# Altium project DSI_host_board.PrjPcb (part 2 of 2)

## Sheet adv_block.SchDoc
size A4
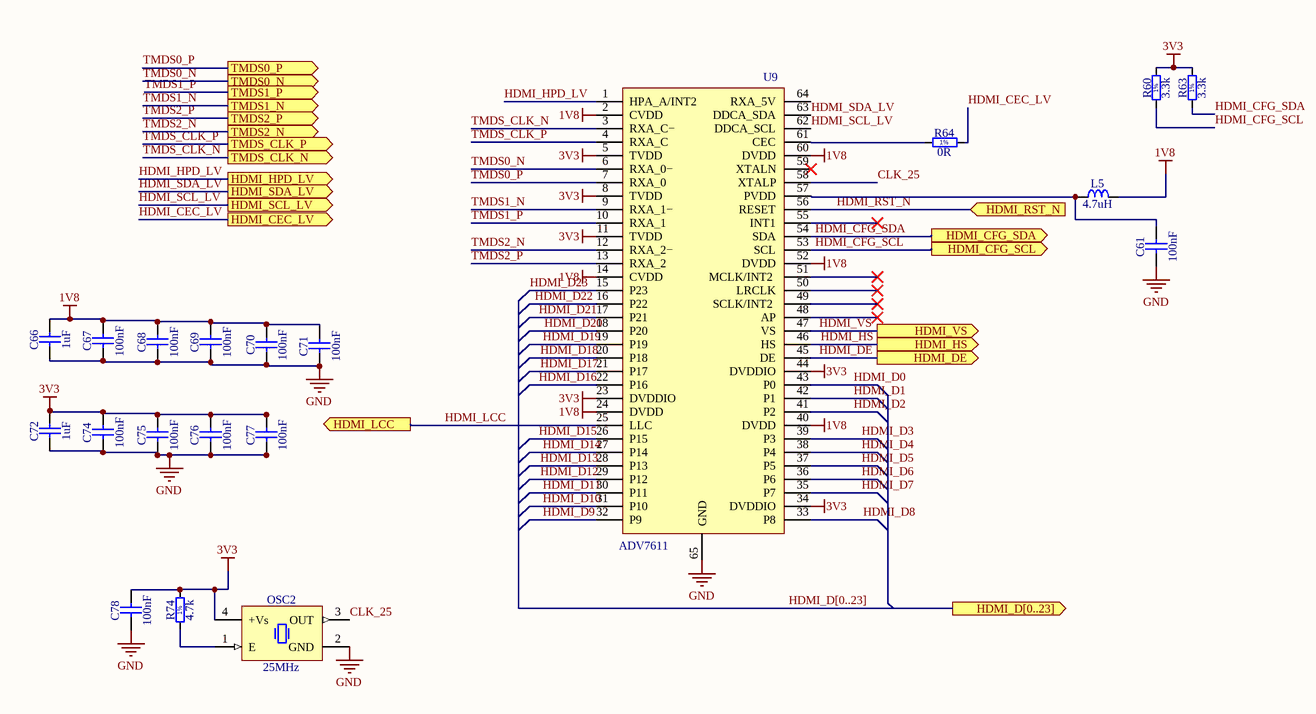
[diagram p4: adv_block.SchDoc]

### Parts
C61  100nF  [CAPC1005X55N]
C66  1uF  [CAPC1005X55N]
C67  100nF  [CAPC1005X55N]
C68  100nF  [CAPC1005X55N]
C69  100nF  [CAPC1005X55N]
C70  100nF  [CAPC1005X55N]
C71  100nF  [CAPC1005X55N]
C72  1uF  [CAPC1005X55N]
C74  100nF  [CAPC1005X55N]
C75  100nF  [CAPC1005X55N]
C76  100nF  [CAPC1005X55N]
C77  100nF  [CAPC1005X55N]
C78  100nF  [CAPC1005X55N]
L5  4.7uH  [IND_MURATA_BLM31PG]
OSC2  25MHz  [OSC_IQD_CFPS-69]
R60  3.3k  [RESC1005X40N]
R63  3.3k  [RESC1005X40N]
R64  0R  [RESC1005X40N]
R74  4.7k  [RESC1608X55N]
U9  ADV7611  [QFP50P1200X1200X120-65N-S415]

### Ports
HDMI_CEC_LV (out), HDMI_CFG_SCL (out), HDMI_CFG_SDA (out), HDMI_D[0..23] (out), HDMI_DE (out), HDMI_HPD_LV (out), HDMI_HS (out), HDMI_LCC (out), HDMI_RST_N (in), HDMI_SCL_LV (out), HDMI_SDA_LV (out), HDMI_VS (out), TMDS0_N (out), TMDS0_P (out), TMDS1_N (out), TMDS1_P (out), TMDS2_N (out), TMDS2_P (out), TMDS_CLK_N (out), TMDS_CLK_P (out)

### Nets
1V8: C66.2 C67.2 C68.2 C69.2 C70.2 C71.2 L5.2 U9.2(CVDD) U9.14(CVDD) U9.24(DVDD) U9.40(DVDD) U9.52(DVDD) U9.60(DVDD)
3V3: C72.2 C74.2 C75.2 C76.2 C77.2 C78.2 OSC2.4(+Vs) R60.2 R63.2 R74.2 U9.5(TVDD) U9.8(TVDD) U9.11(TVDD) U9.23(DVDDIO) U9.34(DVDDIO) U9.44(DVDDIO)
GND: C61.1 C66.1 C67.1 C68.1 C69.1 C70.1 C71.1 C72.1 C74.1 C75.1 C76.1 C77.1 C78.1 OSC2.2(GND) U9.65(GND)
CLK_25: OSC2.3(OUT) U9.58(XTALP)
HDMI_CEC_LV: R64.2 ; port HDMI_CEC_LV
HDMI_CFG_SCL: R60.1 U9.53(SCL) ; port HDMI_CFG_SCL
HDMI_CFG_SDA: R63.1 U9.54(SDA) ; port HDMI_CFG_SDA
HDMI_D0: U9.43(P0)
HDMI_D1: U9.42(P1)
HDMI_D2: U9.41(P2)
HDMI_D3: U9.39(P3)
HDMI_D4: U9.38(P4)
HDMI_D5: U9.37(P5)
HDMI_D6: U9.36(P6)
HDMI_D7: U9.35(P7)
HDMI_D8: U9.33(P8)
HDMI_D9: U9.32(P9)
HDMI_D10: U9.31(P10)
HDMI_D11: U9.30(P11)
HDMI_D12: U9.29(P12)
HDMI_D13: U9.28(P13)
HDMI_D14: U9.27(P14)
HDMI_D15: U9.26(P15)
HDMI_D16: U9.22(P16)
HDMI_D17: U9.21(P17)
HDMI_D18: U9.20(P18)
HDMI_D19: U9.19(P19)
HDMI_D20: U9.18(P20)
HDMI_D21: U9.17(P21)
HDMI_D22: U9.16(P22)
HDMI_D23: U9.15(P23)
HDMI_DE: U9.45(DE) ; port HDMI_DE
HDMI_HPD_LV: U9.1(HPA_A/INT2) ; port HDMI_HPD_LV
HDMI_HS: U9.46(HS) ; port HDMI_HS
HDMI_LCC: U9.25(LLC) ; port HDMI_LCC
HDMI_RST_N: U9.56(RESET) ; port HDMI_RST_N
HDMI_SCL_LV: U9.62(DDCA_SCL) ; port HDMI_SCL_LV
HDMI_SDA_LV: U9.63(DDCA_SDA) ; port HDMI_SDA_LV
HDMI_VS: U9.47(VS) ; port HDMI_VS
TMDS0_N: U9.6(RXA_0−) ; port TMDS0_N
TMDS0_P: U9.7(RXA_0) ; port TMDS0_P
TMDS1_N: U9.9(RXA_1−) ; port TMDS1_N
TMDS1_P: U9.10(RXA_1) ; port TMDS1_P
TMDS2_N: U9.12(RXA_2−) ; port TMDS2_N
TMDS2_P: U9.13(RXA_2) ; port TMDS2_P
TMDS_CLK_N: U9.3(RXA_C−) ; port TMDS_CLK_N
TMDS_CLK_P: U9.4(RXA_C) ; port TMDS_CLK_P
NetC61_2: C61.2 L5.1 U9.57(PVDD)
NetOSC2_1: OSC2.1(E) R74.1
NetR64_1: R64.1 U9.61(CEC)

Not connected (* = marked no-connect by the designer): U9 48(AP)* 49(SCLK/INT2_)* 50(LRCLK)* 51(MCLK/INT2_)* 55(INT1)* 59(XTALN)* 64(RXA_5V)

### Buses and harness runs
bus HDMI_D[0..23] = port HDMI_D[0..23]

### Notes on the sheet
- (in symbol R0402_10K_1%_0.0625W_100PPM) 1%
- (in symbol R0603_100K_1%_0.1W_100PPM) 1%

### Library data of the parts
C61 C67-C71 C74-C78 = CC0402_100NF_16V_10%_X5R: Non-polarised capacitor; Part Description: SMD Multilayer Chip Ceramic Capacitor; Manufacturer: GENERIC; Manufacturer1 Part Number: GRM155R61C104KA88D; Voltage: 16V; TC: X5R; Tolerance: ±10%; Part Number: CC0402_100NF_16V_10%_X5R; Component Kind: Standard; Component Type: Standard; Pin Count: 2; Value: 100nF; Status: None; Manufacturer Part Number: CC0402_100NF_16V_10%_X5R; Case: 0402; Mounted: Yes; Socket: No; SMD: Yes; Sense: No; Manufacturer1 Example: MURATA; Manufacturer1 ComponentHeight: 0.55mm; HelpURL: \\cern.ch\dfs\Applications\Altium\Datasheets\CC0402_X5R_MURATA_GRM.pdf; Author: CERN DEM JLC; CreateDate: 10.12.2013; LatestRevisionDate: 10.12.2013
C66 C72 = CC0402_100NF_16V_10%_X5R: Non-polarised capacitor; Part Description: SMD Multilayer Chip Ceramic Capacitor; Manufacturer: GENERIC; Manufacturer1 Part Number: GRM155R61C104KA88D; Value: 100nF; Voltage: 16V; TC: X5R; Tolerance: ±10%; Part Number: CC0402_100NF_16V_10%_X5R; Component Kind: Standard; Component Type: Standard; Pin Count: 2; Status: None; Manufacturer Part Number: CC0402_100NF_16V_10%_X5R; Case: 0402; Mounted: Yes; Socket: No; SMD: Yes; Sense: No; Manufacturer1 Example: MURATA; Manufacturer1 ComponentHeight: 0.55mm; HelpURL: \\cern.ch\dfs\Applications\Altium\Datasheets\CC0402_X5R_MURATA_GRM.pdf; Author: CERN DEM JLC; CreateDate: 10.12.2013; LatestRevisionDate: 10.12.2013
L5 = IND1206_MURATA_BLM31PG500SN1: Inductor; Part Description: SMD EMIFIL Chip Ferrite Bead; Manufacturer: MURATA; Value: 50R@100MHz; Power: 3.5A; Resistance: 0.015R; Part Number: IND1206_MURATA_BLM31PG500SN1; Component Kind: Standard; Component Type: Standard; Pin Count: 2; Status: None; Manufacturer Part Number: BLM31PG500SN1; Case: 1206; Mounted: Yes; Socket: No; SMD: Yes; Sense: No; ComponentHeight: 1.3mm; HelpURL: \\cern.ch\dfs\Applications\Altium\Datasheets\IND1206_MURATA_BLM31P.pdf; Author: CERN DEM JLC; CreateDate: 05.12.2013; LatestRevisionDate: 05.12.2013
OSC2 = OSC_50MHZ_IQD_LFSPXO009592: Oscillator 4 pins 1=E 2=GND 3=OUT 4=+Vs; Part Description: 3.3V, ±50ppm,  -40..85°C, CMOS Surface Mount Clock Oscillator, Low Current (CFPS-69 Series); Manufacturer: IQD FREQUENCY PRODUCTS; Value: 50MHz; PressFit: No; Bonding: No; Part Number: OSC_50MHZ_IQD_LFSPXO009592; Component Kind: Standard; Component Type: Standard; PackageDescription: Oscillator, Side Concave, 2.54mm Pitch, 4 Pins, 3.20mm L X 5.00mm W X 1.00mm H, CFPS-69 Series; Manufacturer Part Number: LFSPXO009592; Pin Count: 4; Mounted: Yes; Socket: No; SMD: Yes; Sense: No; ComponentHeight: 0.95mm; HelpURL: \\cern.ch\dfs\Applications\Altium\Datasheets\OSC_IQD_LFSPXO009592.pdf; Author: CERN DEM JLC; CreateDate: 16.03.2010; LatestRevisionDate: 07.11.2016
R60 R63 R64 = R0402_10K_1%_0.0625W_100PPM: Resistor - 1%; Part Description: General Purpose Thick Film Chip Resistor; Manufacturer: GENERIC; Manufacturer1 Part Number: 232270671003L; Value: 10k; TC: ±100ppm/°C; PressFit: No; Part Number: R0402_10K_1%_0.0625W_100PPM; Component Kind: Standard; Component Type: Standard; Pin Count: 2; Status: Not Recommended; Power: 0.0625W; Tolerance: ±1%; Manufacturer Part Number: R0402_10K_1%_0.0625W_100PPM; Case: 0402; Mounted: Yes; Sense: No; Socket: No; SMD: Yes; Manufacturer1 Example: YAGEO PHYCOMP; Manufacturer1 ComponentHeight: 0.4mm; HelpURL: \\cern.ch\dfs\Applications\Altium\Datasheets\R0402_Phycomp_RC0402.pdf; Author: CERN DEM JLC; CreateDate: 03.12.2007; LatestRevisionDate: 17.10.2012
R74 = R0603_100K_1%_0.1W_100PPM: as R7 on sheet sdram_block; Part Number: R0603_100K_1%_0.1W_100PPM; Component Kind: Standard; Component Type: Standard; Pin Count: 2; Status: Preferred; Tolerance: ±1%; Manufacturer Part Number: R0603_100K_1%_0.1W_100PPM; Case: 0603; Mounted: Yes; Sense: No; Socket: No; SMD: Yes; Manufacturer1 Example: NIC COMPONENT; Manufacturer1 ComponentHeight: 0.55mm; HelpURL: \\cern.ch\dfs\Applications\Altium\Datasheets\R0603_NIC_NRC.pdf; Author: CERN DEM JLC; CreateDate: 03.12.2007; LatestRevisionDate: 13.03.2008
U9 = ADV7611: Low Power 165 MHz HDMI Receiver

## Sheet power_block.SchDoc
size A4
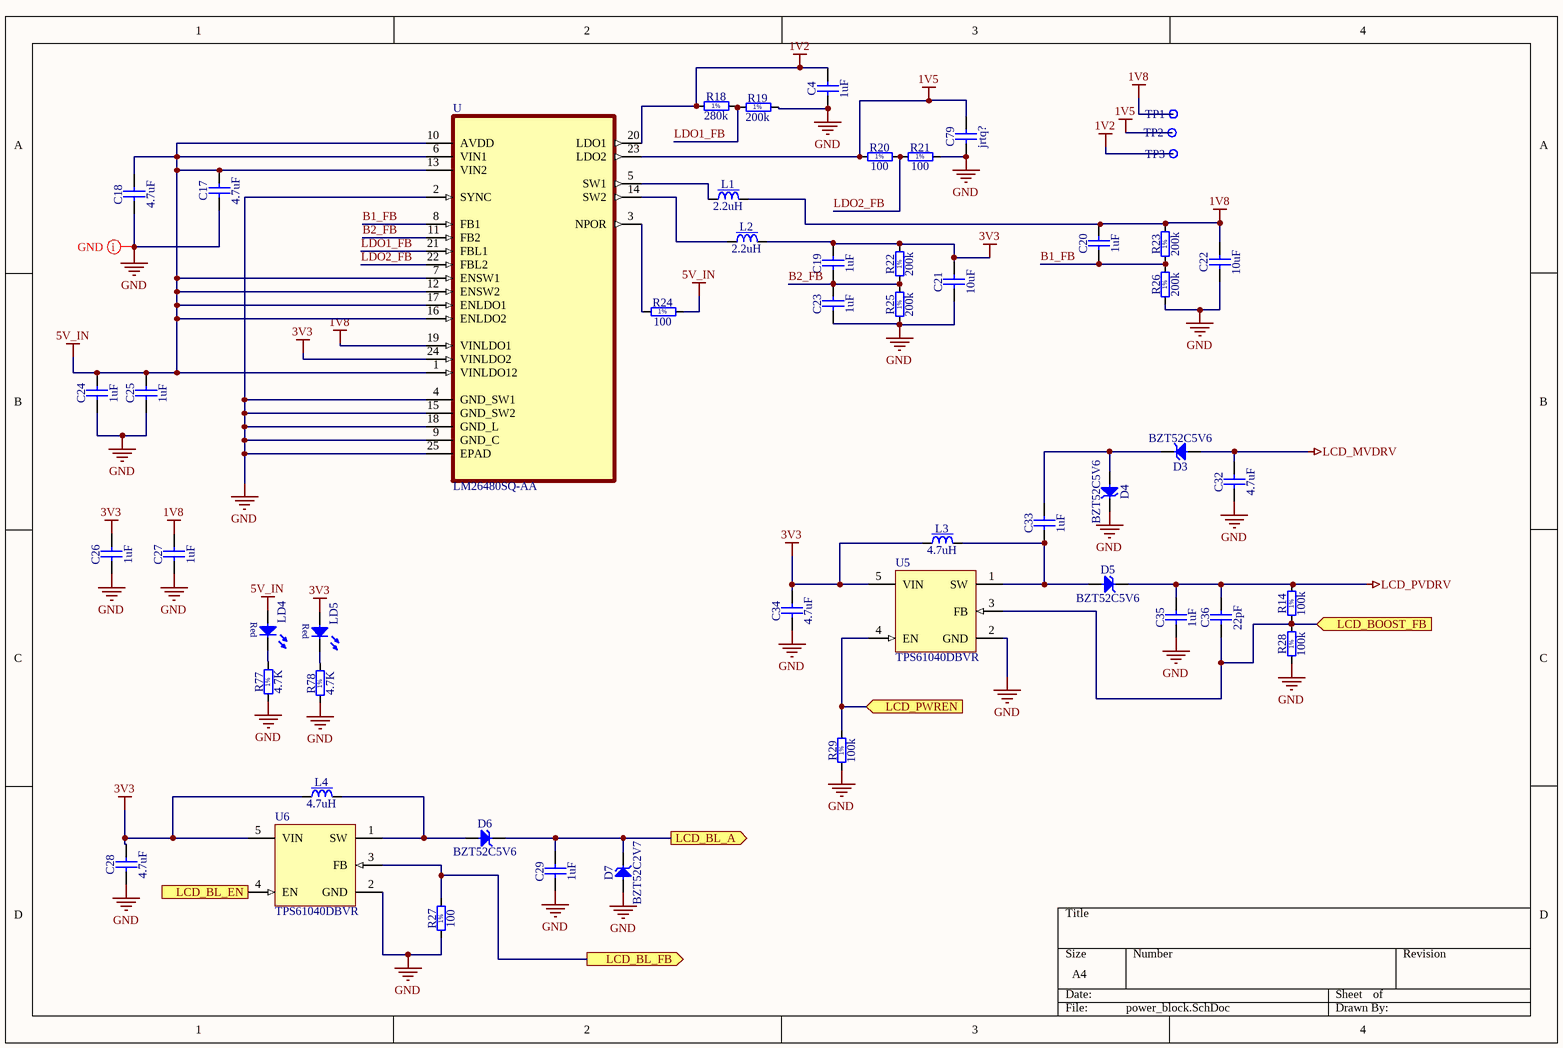
[diagram p5: power_block.SchDoc]

### Parts
C4  1uF  [CAPC2013X100N]
C17  4.7uF  [CAPC2013X100N]
C18  4.7uF  [CAPC2013X100N]
C19  1uF  [CAPC2013X100N]
C20  1uF  [CAPC2013X100N]
C21  10uF  [CAPC2013X100N]
C22  10uF  [CAPC2013X100N]
C23  1uF  [CAPC2013X100N]
C24  1uF  [CAPC2013X100N]
C25  1uF  [CAPC2013X100N]
C26  1uF  [CAPC2013X100N]
C27  1uF  [CAPC2013X100N]
C28  4.7uF  [CAPC2013X100N]
C29  1uF  [CAPC2013X100N]
C32  4.7uF  [CAPC2013X100N]
C33  1uF  [CAPC2013X100N]
C34  4.7uF  [CAPC2013X100N]
C35  1uF  [CAPC2013X100N]
C36  22pF  [CAPC2013X100N]
C79  jrtq?  [CAPC2013X100N]
D3  BZT52C5V6  [SOD3715X145N]
D4  BZT52C5V6  [SOD3715X145N]
D5  BZT52C5V6  [SOD3715X145N]
D6  BZT52C5V6  [SOD3715X145N]
D7  BZT52C2V7  [SOD3715X145N]
L1  2.2uH  [IND_MURATA-PS_8200]
L2  2.2uH  [IND_MURATA-PS_8200]
L3  4.7uH  [IND_MURATA-PS_8200]
L4  4.7uH  [IND_MURATA-PS_8200]
LD4  Super Red  [LED_OSRAM_LSR976]  (value not drawn)
LD5  Super Red  [LED_OSRAM_LSR976]  (value not drawn)
R14  100k  [RESC1608X55N]
R18  280k  [RESC1608X55N]
R19  200k  [RESC1608X55N]
R20  100  [RESC1608X55N]
R21  100  [RESC1608X55N]
R22  200k  [RESC1608X55N]
R23  200k  [RESC1608X55N]
R24  100  [RESC1608X55N]
R25  200k  [RESC1608X55N]
R26  200k  [RESC1608X55N]
R27  100  [RESC1608X55N]
R28  100k  [RESC1608X55N]
R29  100k  [RESC1608X55N]
R77  4.7K  [RESC1608X55N]
R78  4.7K  [RESC1608X55N]
TP1  Test Point  [TPS127]  (value not drawn)
TP2  Test Point  [TPS127]  (value not drawn)
TP3  Test Point  [TPS127]  (value not drawn)
U  LM26480SQ-AA  [QFN400X400X80-25N]
U5  TPS61040DBVR  [TI-DBV5_L]
U6  TPS61040DBVR  [TI-DBV5_L]

### Ports
LCD_BL_A (out), LCD_BL_EN (in), LCD_BL_FB (out), LCD_BOOST_FB (in), LCD_PWREN (in)

### Nets
1V2: C4.2 R18.1 TP3.1 U.20(LDO1)
1V5: C79.2 R20.1 TP2.1 U.23(LDO2)
1V8: C20.2 C22.2 C27.2 L1.2 R23.2 TP1.1 U.19(VINLDO1)
3V3: C19.2 C21.2 C26.2 C28.2 C34.2 L2.2 L3.1 L4.1 LD5.2(A) R22.2 U.24(VINLDO2) U5.5(VIN) U6.5(VIN)
5V_IN: C17.2 C18.2 C24.2 C25.2 LD4.2(A) R24.2 U.1(VINLDO12) U.6(VIN1) U.7(ENSW1) U.10(AVDD) U.12(ENSW2) U.13(VIN2) U.16(ENLDO2) U.17(ENLDO1)
GND: C4.1 C17.1 C18.1 C21.1 C22.1 C23.1 C24.1 C25.1 C26.1 C27.1 C28.1 C29.1 C32.1 C34.1 C35.1 C79.1 D4.1(C) D7.2(A) R19.2 R21.2 R25.1 R26.1 R27.1 R28.1 R29.1 R77.1 R78.1 U.2(SYNC) U.4(GND_SW1) U.9(GND_C) U.15(GND_SW2) U.18(GND_L) U.25(EPAD) U5.2(GND) U6.2(GND)
LCD_MVDRV: C32.2 D3.2(A)
LCD_PVDRV: C35.2 C36.2 D5.1(C) R14.2
B1_FB: C20.1 R23.1 R26.2 U.8(FB1)
B2_FB: C19.1 C23.2 R22.1 R25.2 U.11(FB2)
LCD_BL_A: C29.2 D6.1(C) D7.1(C) ; port LCD_BL_A
LCD_BL_FB: R27.2 U6.3(FB) ; port LCD_BL_FB
LCD_BOOST_FB: C36.1 R14.1 R28.2 U5.3(FB) ; port LCD_BOOST_FB
LCD_PWREN: R29.2 U5.4(EN) ; port LCD_PWREN
LDO1_FB: R18.2 R19.1 U.21(FBL1)
LDO2_FB: R20.2 R21.1 U.22(FBL2)
NetC33_1: C33.1 D5.2(A) L3.2 U5.1(SW)
NetC33_2: C33.2 D3.1(C) D4.2(A)
NetD6_2: D6.2(A) L4.2 U6.1(SW)
NetL1_1: L1.1 U.5(SW1)
NetL2_1: L2.1 U.14(SW2)
NetLD4_1: LD4.1(C) R77.2
NetLD5_1: LD5.1(C) R78.2
NetR24_1: R24.1 U.3(NPOR)
NetU6_4: U6.4(EN) ; port LCD_BL_EN

### Layout directives
rule Clearance Constraint [Clearance = 0.1mm]: GND

### Notes on the sheet
- (in symbol LED_OSRAM_LSR976) Red
- (in symbol R0603_100K_1%_0.1W_100PPM) 1%

### Library data of the parts
C4 C17-C29 C32-C36 C79 = CC0805_1.5NF_50V_5%_C0G: as C6 on sheet sdram_block; Part Number: CC0805_1.5NF_50V_5%_C0G; Component Kind: Standard; Component Type: Standard; Pin Count: 2; Status: Preferred; Manufacturer Part Number: CC0805_1.5NF_50V_5%_C0G; Case: 0805; Mounted: Yes; Socket: No; SMD: Yes; Sense: No; Manufacturer1 Example: KEMET; Manufacturer1 ComponentHeight: 1mm; HelpURL: \\cern.ch\dfs\Applications\Altium\Datasheets\CC0805_C0G_KEMET_(Commercial Grade).pdf; Author: CERN DEM BC; CreateDate: 18.11.2015; LatestRevisionDate: 18.11.2015
D3-D6 = BZT52C5V6: Zener Diode; Part Description: Surface Mount Zener Diode; Manufacturer: DIODES INCORPORATED; Voltage: 5V6; Power: 0.5W; PressFit: No; Bonding: No; Part Number: BZT52C5V6; Component Kind: Standard; Component Type: Standard; Device: BZT52C5V6; PackageDescription: SOD Diode (SOD123); 2.70mm W X 1.55mm L X 1.45mm H body, IPC Medium Density; Manufacturer Part Number: BZT52C5V6; Pin Count: 2; Case: SOD123; Mounted: Yes; Socket: No; SMD: Yes; Sense: No; ComponentHeight: 1.45mm; HelpURL: \\cern.ch\dfs\Applications\Altium\Datasheets\BZT52C5V6.pdf; Author: CERN DEM JLC; CreateDate: 02.03.2015; LatestRevisionDate: 02.03.2015
D7 = BZT52C2V7: Zener Diode; Part Description: Surface Mount Zener Diode; Manufacturer: DIODES INCORPORATED; Voltage: 2V7; Power: 500mW; PressFit: No; Bonding: No; Part Number: BZT52C2V7; Component Kind: Standard; Component Type: Standard; Device: BZT52C2V7; PackageDescription: SOD Diode (SOD123); 2.70mm W X 1.55mm L X 1.45mm H body, IPC Medium Density; Manufacturer Part Number: BZT52C2V7; Pin Count: 2; Case: SOD123; Mounted: Yes; Socket: No; SMD: Yes; Sense: No; ComponentHeight: 1.45mm; HelpURL: \\cern.ch\dfs\Applications\Altium\Datasheets\BZT52C2V7.pdf; Author: CERN DEM JLC; CreateDate: 02.03.2015; LatestRevisionDate: 02.03.2015
L1-L4 = IND_22UH_10%_MURATA-PS_8200: Inductor With Core; Part Description: Miniature Surface Mount Power Inductor (8200 Series); Manufacturer: MURATA POWER SOLUTIONS; Manufacturer Part Number: 82223C; Value: 22uH; Power: 320mA; Resistance: 0.92R; Tolerance: ±10%; Part Number: IND_22UH_10%_MURATA-PS_8200; Component Kind: Standard; Component Type: Standard; Pin Count: 2; Status: None; Mounted: Yes; Socket: No; SMD: Yes; Sense: No; ComponentHeight: 2.3mm; HelpURL: \\cern.ch\dfs\Applications\Altium\Datasheets\IND_MURATA-PS_8200.pdf; Author: CERN DEM JMW; CreateDate: 07.10.2015; LatestRevisionDate: 07.10.2015
LD4 LD5 = LED_OSRAM_LSR976: LED Red 1C 2A; Part Description: Surface Mount Super Red LED (0805 Case); Manufacturer: OSRAM; Manufacturer Part Number: LSR976; PressFit: No; Bonding: No; Part Number: LED_OSRAM_LSR976; Component Kind: Standard; Component Type: Standard; Color: Super Red; PackageDescription: Super Red Chip LED, 2-Leads, Body 2 x1.25mm, IPC Medium Density; Pin Count: 2; Case: 0805; Mounted: Yes; Socket: No; SMD: Yes; Sense: No; ComponentHeight: 0.9mm; HelpURL: \\cern.ch\dfs\Applications\Altium\Datasheets\LED_OSRAM_LSR976.pdf; Author: CERN DEM JLC; CreateDate: 18.05.2010; LatestRevisionDate: 18.05.2010
R14 R28 R29 = R0603_100K_1%_0.1W_100PPM: Resistor - 1%; Part Description: General Purpose Thick Film Chip Resistor; Manufacturer: GENERIC; Manufacturer1 Part Number: NRC06F1003TRF; Power: 0.1W; TC: ±100ppm/°C; PressFit: No; Part Number: R0603_100K_1%_0.1W_100PPM; Component Kind: Standard; Component Type: Standard; Pin Count: 2; Value: 100k; Status: Preferred; Tolerance: ±1%; Manufacturer Part Number: R0603_100K_1%_0.1W_100PPM; Case: 0603; Mounted: Yes; Sense: No; Socket: No; SMD: Yes; Manufacturer1 Example: NIC COMPONENT; Manufacturer1 ComponentHeight: 0.55mm; HelpURL: \\cern.ch\dfs\Applications\Altium\Datasheets\R0603_NIC_NRC.pdf; Author: CERN DEM JLC; CreateDate: 03.12.2007; LatestRevisionDate: 13.03.2008
R18-R27 R77 R78 = R0603_100K_1%_0.1W_100PPM: as R7 on sheet sdram_block; Part Number: R0603_100K_1%_0.1W_100PPM; Component Kind: Standard; Component Type: Standard; Pin Count: 2; Status: Preferred; Tolerance: ±1%; Manufacturer Part Number: R0603_100K_1%_0.1W_100PPM; Case: 0603; Mounted: Yes; Sense: No; Socket: No; SMD: Yes; Manufacturer1 Example: NIC COMPONENT; Manufacturer1 ComponentHeight: 0.55mm; HelpURL: \\cern.ch\dfs\Applications\Altium\Datasheets\R0603_NIC_NRC.pdf; Author: CERN DEM JLC; CreateDate: 03.12.2007; LatestRevisionDate: 13.03.2008
TP1-TP3 = SMD_PAD_1.27X1.27MM: Part Description: 1.27mm x 1.27mm PCB Copper Area (SMD Test Point); Mounted: No; Part Number: SMD_PAD_1.27X1.27MM; Component Kind: Standard (No BOM); Component Type: Standard (No BOM); Pin Count: 1; Family: Test Point; Socket: No; SMD: Yes; Sense: No; Status: None; ComponentHeight: 0mm; HelpURL: Undefined; Author: CERN DEM JLC; CreateDate: 12.01.2008; LatestRevisionDate: 12.01.2008; PackageDescription: 1.27mm x 1.27mm PCB Copper Area (SMD Test Point)
U = LM26480SQ-AA: PMIC - Voltage Regulators - Linear + Switching 4 Output Step-Down _Buck_ Synchronous _2_, Linear _LDO_ _2_ 2MHz 24-WQFN _4x4_; MF: Texas Instruments; Package: WQFN-24 Texas Instruments; MP: LM26480SQ-AA; Value: *; Availability: Unavailable; Price: None; SnapEDA_Link: https://www.snapeda.com/parts/LM26480SQ-AA/Texas%20Instruments/view-part/28484/?ref=snap
U5 U6 = TPS61040DBVR: 28 V, 400 mA Switch Boost Converter for White LED Applications, 1.8 to 6 V, -40 to 85 degC, 5-pin SOT23 (DBV5), Green (RoHS & no Sb/Br); Manufacturer: Texas Instruments; Dimming: TRUE; Iout(Max)(A): 0.09; Iq(Typ)(mA): 0.028; Rating: Catalog; SubFamily: White LED Driver; Switching Frequency(Max)(kHz): 1000; Vin(Max)(V): 6; Vin(Min)(V): 1.8; DatasheetVersion: SLVS413F; PackageVersion: 4073253-4/K; PackageReference: DBV5; PackageDescription: 5-Pin Plastic Small Outline, Body 1.60 Г— 2.90 mm, Pitch 0.95 mm; Supplier 1: Digi-Key; Supplier Part Number 1: 296-12685-2-ND; Supplier 2: Digi-Key; Supplier Part Number 2: 296-12685-1-ND; Supplier 3: Digi-Key; Supplier Part Number 3: 296-12685-6-ND; Supplier 4: Farnell; Supplier Part Number 4: 1461061; Supplier 5: Farnell; Supplier Part Number 5: 1461061RL; Supplier 6: Newark; Supplier Part Number 6: 35K1326; Supplier 7: Mouser; Supplier Part Number 7: 595-TPS61040DBVR; Eco-Plan: Green (RoHS & no Sb/Br); Topology: Boost; Mounting Technology: Surface Mount; Code_JEDEC: MO-178; PartNumber: TPS61040DBVR; ComponentLink1Description: Manufacturer URL; ComponentLink1URL: http://www.ti.com/; ComponentLink2Description: Datasheet; ComponentLink2URL: http://www.ti.com/general/docs/lit/getliterature.tsp?genericPartNumber=TPS61040&fileType=pdf; ComponentLink3Description: Package Specification; ComponentLink3URL: http://www.ti.com/litv/pdf/mpds018i

## Sheet uartjtag_block.SchDoc
size A4
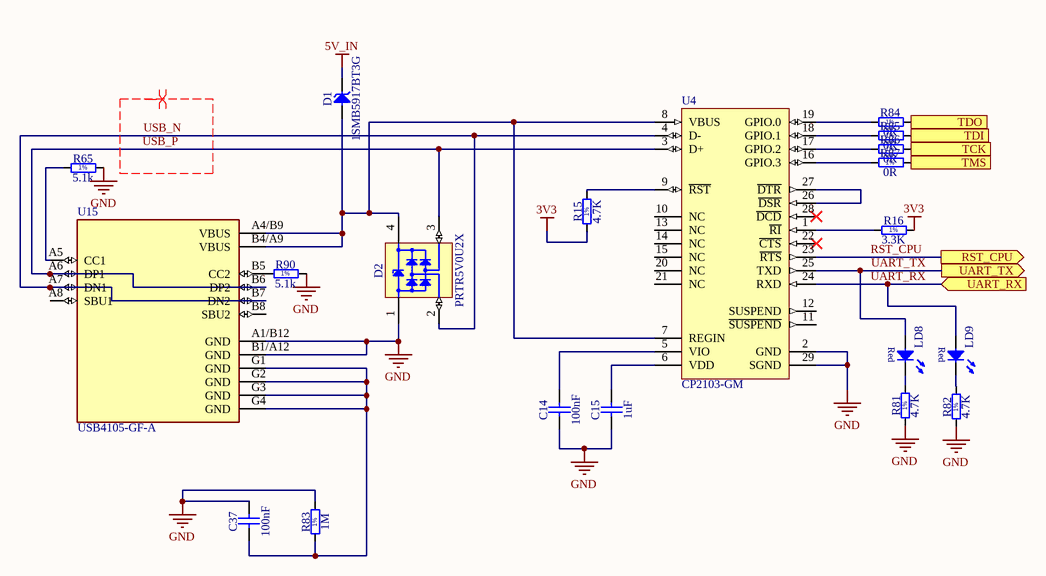
[diagram p6: uartjtag_block.SchDoc]

### Parts
C14  100nF  [CAPC2013X100N]
C15  1uF  [CAPC2013X100N]
C37  100nF  [CAPC2013X100N]
D1  1SMB5917BT3G  [DIOM5436X244N]
D2  PRTR5V0U2X  [SOT190P230X110-4N]
LD8  Super Red  [LED_OSRAM_LSR976]  (value not drawn)
LD9  Super Red  [LED_OSRAM_LSR976]  (value not drawn)
R15  4.7K  [RESC1608X55N]
R16  3.3K  [RESC1608X55N]
R65  5.1k  [RESC1608X55N]
R81  4.7K  [RESC1608X55N]
R82  4.7K  [RESC1608X55N]
R83  1M  [RESC1608X55N]
R84  0R  [RESC1608X55N]
R85  0R  [RESC1608X55N]
R86  0R  [RESC1608X55N]
R87  0R  [RESC1608X55N]
R90  5.1k  [RESC1608X55N]
U4  CP2103-GM  [SLAB-QFN-28-3125x3125TP_A_L]
U15  USB4105-GF-A  [GCT_USB4105-GF-A]

### Ports
RST_CPU (out), TCK (out), TDI (out), TDO (in), TMS (out), UART_RX (in), UART_TX (out)

### Nets
3V3: R15.1 R16.2
5V_IN: D1.1(C)
GND: C14.1 C15.1 C37.2 D2.1(GND) R65.2 R81.1 R82.1 R83.2 R90.2 U4.2(GND) U4.29(SGND) U15.A1/B12(GND) U15.B1/A12(GND)
RST_CPU: U4.23(~{RTS}) ; port RST_CPU
TCK: R86.2 ; port TCK
TDI: R85.2 ; port TDI
TDO: R84.2 ; port TDO
TMS: R87.2 ; port TMS
UART_RX: LD9.2(A) U4.24(RXD) ; port UART_RX
UART_TX: LD8.2(A) U4.25(TXD) ; port UART_TX
USB_N: D2.2(I/O1) U4.4(D-) U15.A7(DN1) U15.B7(DN2)
USB_P: D2.3(I/O2) U4.3(D+) U15.A6(DP1) U15.B6(DP2)
NetC14_2: C14.2 U4.5(VIO)
NetC15_2: C15.2 U4.6(VDD)
NetC37_1: C37.1 R83.1 U15.G1(GND) U15.G2(GND) U15.G3(GND) U15.G4(GND)
NetD1_2: D1.2(A) D2.4(VCC) U4.7(REGIN) U4.8(VBUS) U15.A4/B9(VBUS) U15.B4/A9(VBUS)
NetLD8_1: LD8.1(C) R81.2
NetLD9_1: LD9.1(C) R82.2
NetR15_2: R15.2 U4.9(~{RST})
NetR16_1: R16.1 U4.1(~{RI})
NetR65_1: R65.1 U15.A5(CC1)
NetR84_1: R84.1 U4.19(GPIO.0)
NetR85_1: R85.1 U4.18(GPIO.1)
NetR86_1: R86.1 U4.17(GPIO.2)
NetR87_1: R87.1 U4.16(GPIO.3)
NetR90_1: R90.1 U15.B5(CC2)
NetU4_26: U4.26(~{DSR}) U4.27(~{DTR})

Not connected (* = marked no-connect by the designer): U4 10(NC) 11(~{SUSPEND}) 12(SUSPEND) 13(NC) 14(NC) 15(NC) 20(NC) 21(NC) 22(~{CTS})* 28(~{DCD})*; U15 A8(SBU1) B8(SBU2)

### Layout directives
differential pair; net class USB_LINES; rule Differential Pairs Routing [Pref Gap = 0.2mm    Min Gap  = 0.2mm    Max Gap  = 0.3mmPref Width = 0.2mm    Min Width  = 0.2mm    Max Width  = 0.3mm]: USB_N, USB_P

### Notes on the sheet
- (in symbol LED_OSRAM_LSR976) Red
- (in symbol R0603_100K_1%_0.1W_100PPM) 1%

### Library data of the parts
C14 C15 C37 = CC0805_1.5NF_50V_5%_C0G: as C6 on sheet sdram_block; Part Number: CC0805_1.5NF_50V_5%_C0G; Component Kind: Standard; Component Type: Standard; Pin Count: 2; Status: Preferred; Manufacturer Part Number: CC0805_1.5NF_50V_5%_C0G; Case: 0805; Mounted: Yes; Socket: No; SMD: Yes; Sense: No; Manufacturer1 Example: KEMET; Manufacturer1 ComponentHeight: 1mm; HelpURL: \\cern.ch\dfs\Applications\Altium\Datasheets\CC0805_C0G_KEMET_(Commercial Grade).pdf; Author: CERN DEM BC; CreateDate: 18.11.2015; LatestRevisionDate: 18.11.2015
D1 = 1SMB5917BT3G: Zener Diode; Part Description: Plastic Surface Mount Zener Voltage Regulator Diode; Manufacturer: ON SEMICONDUCTOR; Voltage: 4.7V; Power: 3W; PressFit: No; Bonding: No; Part Number: 1SMB5917BT3G; Component Kind: Standard; Component Type: Standard; Device: 1SMB5917BT3G; PackageDescription: DO-214-AA/SMB Diode, Molded Body; 5.40mm L X 3.62mm W X 2.44mm H, IPC Medium Density; Manufacturer Part Number: 1SMB5917BT3G; Pin Count: 2; Case: SMB; Mounted: Yes; Socket: No; SMD: Yes; Sense: No; ComponentHeight: 2.44mm; HelpURL: \\cern.ch\dfs\Applications\Altium\Datasheets\1SMB5917BT3G.pdf; Author: CERN DEM MR; CreateDate: 05.09.2016; LatestRevisionDate: 05.09.2016
D2 = PRTR5V0U2X: Ultra Low Capacitance Double Rail-to-Rail ESD Protection Diode; Part Description: Ultra Low Capacitance (1pF) Double Rail-to-Rail ESD Protection Diode (8kV); Manufacturer: NXP SEMICONDUCTORS; Voltage: 5.5V; PressFit: No; Bonding: No; Part Number: PRTR5V0U2X; Component Kind: Standard; Component Type: Standard; Device: PRTR5V0U2X; PackageDescription: SOT143B, SOT, 1.90mm Pitch; 4 Pin, 1.30mm W X 2.90mm L X 1.10mm H body, IPC Medium Density; Manufacturer Part Number: PRTR5V0U2X; Pin Count: 4; Case: SOT143B; Mounted: Yes; Socket: No; SMD: Yes; Sense: No; ComponentHeight: 1.1mm; HelpURL: \\cern.ch\dfs\Applications\Altium\Datasheets\PRTR5V0U2X.pdf; Author: CERN DEM JLC; CreateDate: 22.03.2011; LatestRevisionDate: 22.03.2011
LD8 LD9 = LED_OSRAM_LSR976: as LD4 on sheet power_block; Part Number: LED_OSRAM_LSR976; Component Kind: Standard; Component Type: Standard; Color: Super Red; PackageDescription: Super Red Chip LED, 2-Leads, Body 2 x1.25mm, IPC Medium Density; Pin Count: 2; Case: 0805; Mounted: Yes; Socket: No; SMD: Yes; Sense: No; ComponentHeight: 0.9mm; HelpURL: \\cern.ch\dfs\Applications\Altium\Datasheets\LED_OSRAM_LSR976.pdf; Author: CERN DEM JLC; CreateDate: 18.05.2010; LatestRevisionDate: 18.05.2010
R15 R16 R65 R81-R87 R90 = R0603_100K_1%_0.1W_100PPM: as R7 on sheet sdram_block; Part Number: R0603_100K_1%_0.1W_100PPM; Component Kind: Standard; Component Type: Standard; Pin Count: 2; Status: Preferred; Tolerance: ±1%; Manufacturer Part Number: R0603_100K_1%_0.1W_100PPM; Case: 0603; Mounted: Yes; Sense: No; Socket: No; SMD: Yes; Manufacturer1 Example: NIC COMPONENT; Manufacturer1 ComponentHeight: 0.55mm; HelpURL: \\cern.ch\dfs\Applications\Altium\Datasheets\R0603_NIC_NRC.pdf; Author: CERN DEM JLC; CreateDate: 03.12.2007; LatestRevisionDate: 13.03.2008
U4 = CP2103-GM: Single-Chip USB to UART Bridge, 1024 Bytes EEPROM, -40 to 85 degC, 28-pin QFN, Tube; Manufacturer: Silicon Labs; Internal Oscillator: TRUE; Sub-Family: USB Bridges; DatasheetVersion: Rev. 1.0; PackageReference: QFN-28; PackageDescription: 28-Pin Quad-Flat No-Leads Package, Body 5 x 5 mm, Pitch 0.5 mm; Supplier 1: Digi-Key; Supplier Part Number 1: 336-1164-ND; Supplier 2: Farnell; Supplier Part Number 2: 1291538; Supplier 3: Newark; Supplier Part Number 3: 24M1109; Supplier 4: Mouser; Supplier Part Number 4: 634-CP2103-GM; EEPROM: 1024 Bytes; Mounting Technology: Surface Mount; PartNumber: CP2103-GM; ComponentLink1Description: Manufacturer URL; ComponentLink1URL: http://www.silabs.com/; ComponentLink2Description: Datasheet; ComponentLink2URL: http://www.silabs.com/Support%20Documents/TechnicalDocs/CP2103.pdf; ComponentLink3Description: Package Specification; ComponentLink3URL: http://www.silabs.com/Support%20Documents/TechnicalDocs/C8051F35x.pdf
U15 = USB4105-GF-A: USB-C _USB TYPE-C_ USB 2.0 Receptacle Connector 24 _16+8 Dummy_ Position Surface Mount, Right Angle; Through Hole; MF: GCT; SnapEDA_Link: https://www.snapeda.com/parts/USB4105-GF-A/Global%20Connector%20Technology/view-part/4423780/?ref=snap; Price: None; Availability: Unavailable; Package: None; MP: USB4105-GF-A; Value: *

## Sheet hdmi_block.SchDoc
size A4; DrawnBy: ee; SheetTotal: HDMI Socket with ESD protection and level translator
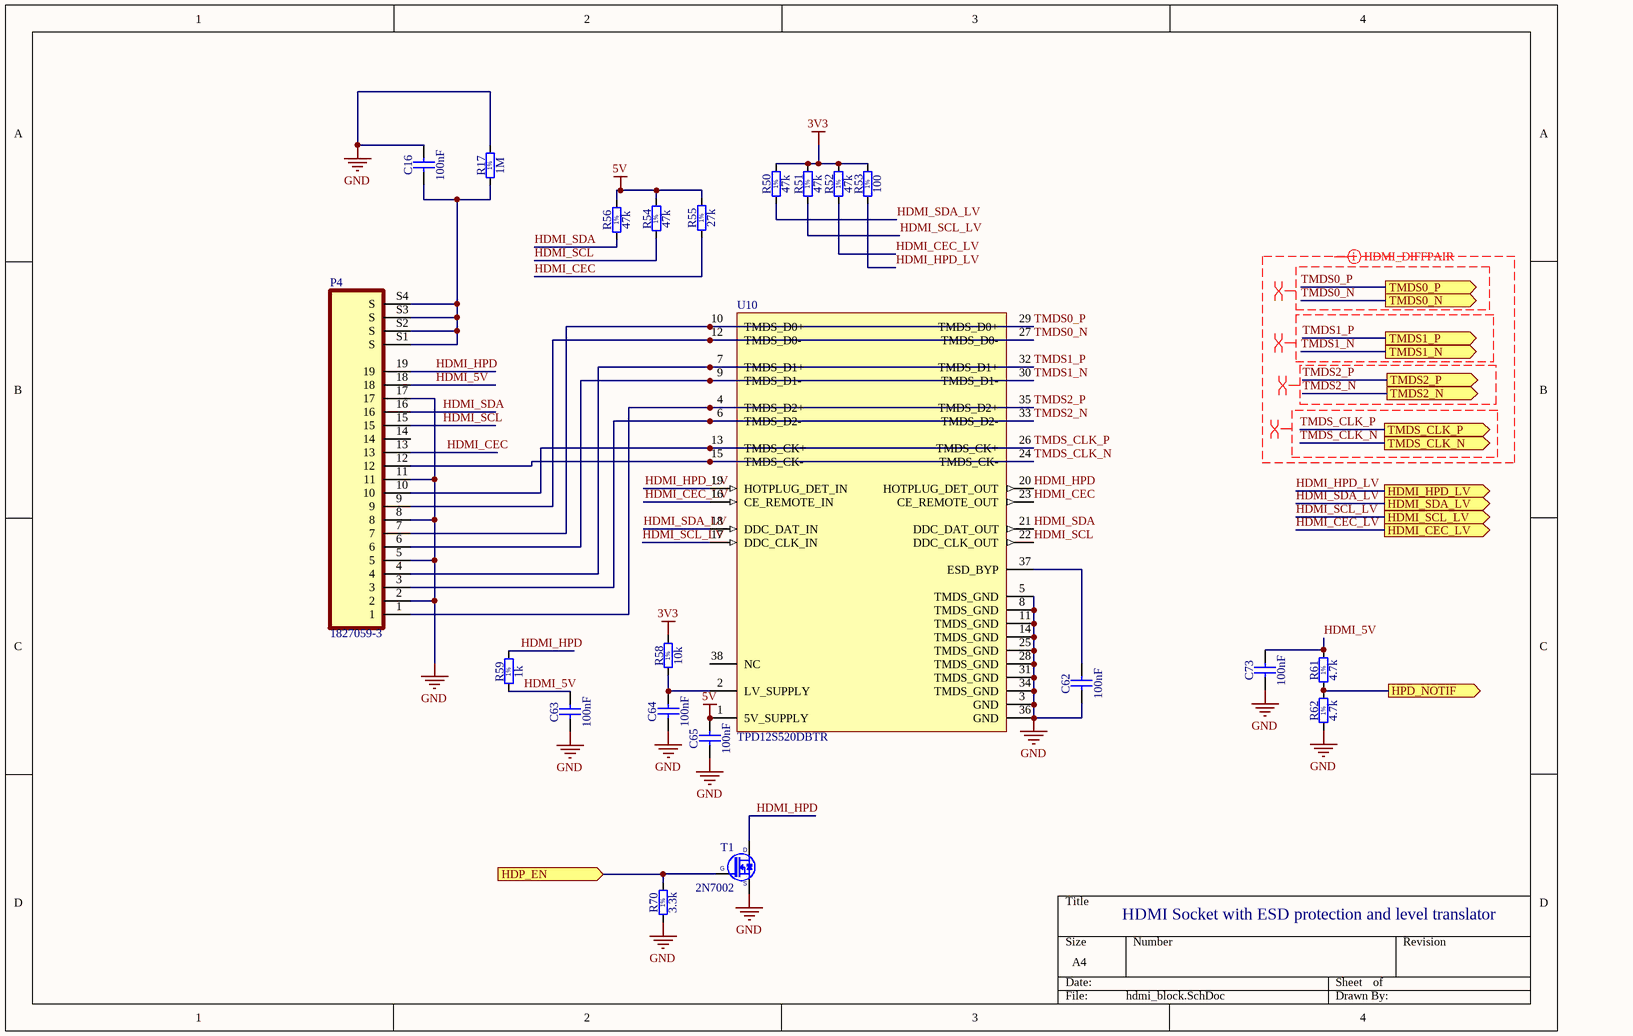
[diagram p7: hdmi_block.SchDoc]

### Parts
C16  100nF  [CAPC2013X100N]
C62  100nF  [CAPC2013X100N]
C63  100nF  [CAPC2013X100N]
C64  100nF  [CAPC2013X100N]
C65  100nF  [CAPC2013X100N]
C73  100nF  [CAPC2013X100N]
P4  1827059-3  [TE_1827059-3]
R17  1M  [RESC1608X55N]
R50  47k  [RESC1608X55N]
R51  47k  [RESC1608X55N]
R52  47k  [RESC1608X55N]
R53  100  [RESC1608X55N]
R54  47k  [RESC1608X55N]
R55  27k  [RESC1608X55N]
R56  47k  [RESC1608X55N]
R58  10k  [RESC1608X55N]
R59  1k  [RESC1608X55N]
R61  4.7k  [RESC1608X55N]
R62  4.7k  [RESC1608X55N]
R70  3.3k  [RESC1608X55N]
T1  2N7002  [SOT95P240X130-3N]
U10  TPD12S520DBTR  [DBT38_L]

### Ports
HDMI_CEC_LV (out), HDMI_HPD_LV (out), HDMI_SCL_LV (out), HDMI_SDA_LV (out), HDP_EN (in), HPD_NOTIF (out), TMDS0_N (out), TMDS0_P (out), TMDS1_N (out), TMDS1_P (out), TMDS2_N (out), TMDS2_P (out), TMDS_CLK_N (out), TMDS_CLK_P (out)

### Nets
3V3: R50.2 R51.2 R52.2 R53.2 R58.2
5V: C65.2 R54.2 R55.2 R56.2 U10.1(5V_SUPPLY)
GND: C16.2 C62.1 C63.1 C64.1 C65.1 C73.1 P4.2 P4.5 P4.8 P4.11 P4.17 R17.2 R62.1 R70.1 T1.2(S) U10.3(GND) U10.5(TMDS_GND) U10.8(TMDS_GND) U10.11(TMDS_GND) U10.14(TMDS_GND) U10.25(TMDS_GND) U10.28(TMDS_GND) U10.31(TMDS_GND) U10.34(TMDS_GND) U10.36(GND)
HDMI_5V: C63.2 C73.2 P4.18 R59.1 R61.2
HDMI_CEC: P4.13 R55.1 U10.23(CE_REMOTE_OUT)
HDMI_CEC_LV: R52.1 U10.16(CE_REMOTE_IN) ; port HDMI_CEC_LV
HDMI_HPD: P4.19 R59.2 T1.3(D) U10.20(HOTPLUG_DET_OUT)
HDMI_HPD_LV: R53.1 U10.19(HOTPLUG_DET_IN) ; port HDMI_HPD_LV
HDMI_SCL: P4.15 R54.1 U10.22(DDC_CLK_OUT)
HDMI_SCL_LV: R51.1 U10.17(DDC_CLK_IN) ; port HDMI_SCL_LV
HDMI_SDA: P4.16 R56.1 U10.21(DDC_DAT_OUT)
HDMI_SDA_LV: R50.1 U10.18(DDC_DAT_IN) ; port HDMI_SDA_LV
HDP_EN: R70.2 T1.1(G) ; port HDP_EN
HPD_NOTIF: R61.1 R62.2 ; port HPD_NOTIF
TMDS0_N: P4.9 U10.12(TMDS_D0-) U10.27(TMDS_D0-) ; port TMDS0_N
TMDS0_P: P4.7 U10.10(TMDS_D0+) U10.29(TMDS_D0+) ; port TMDS0_P
TMDS1_N: P4.6 U10.9(TMDS_D1-) U10.30(TMDS_D1-) ; port TMDS1_N
TMDS1_P: P4.4 U10.7(TMDS_D1+) U10.32(TMDS_D1+) ; port TMDS1_P
TMDS2_N: P4.3 U10.6(TMDS_D2-) U10.33(TMDS_D2-) ; port TMDS2_N
TMDS2_P: P4.1 U10.4(TMDS_D2+) U10.35(TMDS_D2+) ; port TMDS2_P
TMDS_CLK_N: P4.12 U10.15(TMDS_CK-) U10.24(TMDS_CK-) ; port TMDS_CLK_N
TMDS_CLK_P: P4.10 U10.13(TMDS_CK+) U10.26(TMDS_CK+) ; port TMDS_CLK_P
NetC16_1: C16.1 P4.S1(S) P4.S2(S) P4.S3(S) P4.S4(S) R17.1
NetC62_2: C62.2 U10.37(ESD_BYP)
NetC64_2: C64.2 R58.1 U10.2(LV_SUPPLY)

Not connected (* = marked no-connect by the designer): P4 14; U10 38(NC)

### Layout directives
differential pair; net class HDMI_lines_class; rule Clearance Constraint [Clearance = 0.1mm]; rule Width Constraint [Pref Width = 0.1mm    Min Width = 0.1mm    Max Width = 0.2mm]; rule Differential Pairs Routing [Pref Gap = 0.1mm    Min Gap  = 0.1mm    Max Gap  = 0.25mmPref Width = 0.1mm    Min Width  = 0.1mm    Max Width  = 0.1mm]; rule Matched Net Lengths [Tolerance = 1mm]: TMDS0_N, TMDS0_P, TMDS1_N, TMDS1_P, TMDS2_N, TMDS2_P, TMDS_CLK_N, TMDS_CLK_P
rule Matched Net Lengths [Tolerance = 1mm]: TMDS0_N, TMDS0_P, TMDS1_N, TMDS1_P, TMDS2_N, TMDS2_P, TMDS_CLK_N, TMDS_CLK_P

### Notes on the sheet
- HDMI Socket with ESD protection and level translator
- (in symbol R0603_100K_1%_0.1W_100PPM) 1%

### Library data of the parts
C16 C62-C65 C73 = CC0805_1.5NF_50V_5%_C0G: Non-polarised capacitor; Part Description: SMD Multilayer Chip Ceramic Capacitor; Manufacturer: GENERIC; Manufacturer1 Part Number: C0805C152J5GACTU; Value: 1.5nF; Voltage: 50V; TC: C0G/NP0; Tolerance: ±5%; Part Number: CC0805_1.5NF_50V_5%_C0G; Component Kind: Standard; Component Type: Standard; Pin Count: 2; Status: Preferred; Manufacturer Part Number: CC0805_1.5NF_50V_5%_C0G; Case: 0805; Mounted: Yes; Socket: No; SMD: Yes; Sense: No; Manufacturer1 Example: KEMET; Manufacturer1 ComponentHeight: 1mm; HelpURL: \\cern.ch\dfs\Applications\Altium\Datasheets\CC0805_C0G_KEMET_(Commercial Grade).pdf; Author: CERN DEM BC; CreateDate: 18.11.2015; LatestRevisionDate: 18.11.2015
P4 = 1827059-3: EMBOSS PACKAGE HDMI CONN SMT NO-FLANGE T; MF: TE Connectivity; Availability: Unavailable; Value: *; TE_purchase_URL: https://www.te.com/usa-en/product-1827059-3.html?te_bu=Cor&te_type=disp&te_campaign=seda_glo_cor-seda-global-disp-prtnr-fy19-seda-model-bom-cta_sma-317_1&elqCampaignId=32493; Package: None; Price: None; SnapEDA_Link: https://www.snapeda.com/parts/1827059-3/TE%20Connectivity%20AMP%20Connectors/view-part/1316486/?ref=snap; MP: 1827059-3; EU_RoHS_Compliance: Compliant
R17 R50-R56 R58 R59 R61 R62 R70 = R0603_100K_1%_0.1W_100PPM: Resistor - 1%; Part Description: General Purpose Thick Film Chip Resistor; Manufacturer: GENERIC; Manufacturer1 Part Number: NRC06F1003TRF; Value: 100k; Power: 0.1W; TC: ±100ppm/°C; PressFit: No; Part Number: R0603_100K_1%_0.1W_100PPM; Component Kind: Standard; Component Type: Standard; Pin Count: 2; Status: Preferred; Tolerance: ±1%; Manufacturer Part Number: R0603_100K_1%_0.1W_100PPM; Case: 0603; Mounted: Yes; Sense: No; Socket: No; SMD: Yes; Manufacturer1 Example: NIC COMPONENT; Manufacturer1 ComponentHeight: 0.55mm; HelpURL: \\cern.ch\dfs\Applications\Altium\Datasheets\R0603_NIC_NRC.pdf; Author: CERN DEM JLC; CreateDate: 03.12.2007; LatestRevisionDate: 13.03.2008
T1 = 2N7002: N-CHANNEL MOSFET WITH DIODE; Part Description: 60V 280mA N-Channel Enhancement Mode Field Effect Transistor (FET); Manufacturer: FAIRCHILD SEMICONDUCTOR; PressFit: No; Bonding: No; Part Number: 2N7002; Component Kind: Standard; Component Type: Standard; Device: 2N7002; PackageDescription: SOT23 3-Leads, Pitch 0.95mm - Body 1.3x2.9mm, IPC Medium Density; Manufacturer Part Number: 2N7002; Pin Count: 3; Case: SOT23-3; Mounted: Yes; Socket: No; SMD: Yes; Sense: No; ComponentHeight: 1.3mm; HelpURL: \\cern.ch\dfs\Applications\Altium\Datasheets\2N7002.pdf; Author: CERN DEM JLC; CreateDate: 20.08.2008; LatestRevisionDate: 07.04.2009
U10 = TPD12S520DBTR: HDMI Receiver Port Protection and Interface Device, 12 Channels, -40 to +85 degC, 38-pin TSSOP (DBT), Green (RoHS & no Sb/Br); Manufacturer: Texas Instruments; Breakdown Voltage(Min)(V): 9; Differential Capacitance(pF): 0.05; IEC 61000-4-2 Contact(+/- kV): 8; IO Capacitance(Typ)(pF): 0.9; SubFamily: ESD Solution; DatasheetVersion: SLVS640C; PackageVersion: revI, Mar-2011; PackageReference: DBT38; PackageDescription: 38-Pin Plastic Small Outline 0.5 mm Pitch; Supplier 1: Digi-Key; Supplier Part Number 1: 296-23617-2-ND; Supplier 2: Digi-Key; Supplier Part Number 2: 296-23617-1-ND; Supplier 3: Digi-Key; Supplier Part Number 3: 296-23617-6-ND; Supplier 4: Newark; Supplier Part Number 4: 85M0176; Supplier 5: Mouser; Supplier Part Number 5: 595-TPD12S520DBTR; Eco-Plan: Green (RoHS & no Sb/Br); IO Leakage Current(nA): 0.05; Mounting Technology: Surface Mount; Code_JEDEC: MO-153; PartNumber: TPD12S520DBTR; ComponentLink1Description: Datasheet; ComponentLink1URL: http://www.ti.com/general/docs/lit/getliterature.tsp?genericPartNumber=TPD12S520&fileType=pdf; ComponentLink2Description: URL Link1; ComponentLink2URL: SamplesURL:http://www.ti.com/product/tpd12s520#samples

## Nets that join several sheets
1V2: fpga_block (12 pins), power_block (C4.2 R18.1 TP3.1 U.20)
1V5: sdram_block (29 pins), fpga_block (8 pins), power_block (C79.2 R20.1 TP2.1 U.23)
1V8: host_board (J1.33 J1.34), fpga_block (12 pins), adv_block (13 pins), power_block (7 pins)
3V3: host_board (J1.35 J1.36), fpga_block (52 pins), adv_block (16 pins), power_block (13 pins), uartjtag_block (R15.1 R16.2), hdmi_block (5 pins)
5V_IN: fpga_block (P2.11), power_block (14 pins), uartjtag_block (D1.1)
DDR_VREF: sdram_block (8 pins), fpga_block (C1.2 C30.1 U1.A3 U1.M3)
GND: host_board (14 pins), sdram_block (39 pins), Designator (R3#1.1 R4#1.2), Designator (R3#2.1 R4#2.2), Designator (R3#3.1 R4#3.2), Designator (R3#4.1 R4#4.2), Designator (R3#5.1 R4#5.2), fpga_block (68 pins), adv_block (15 pins), power_block (35 pins), uartjtag_block (13 pins), hdmi_block (25 pins)
LCD_MVDRV: host_board (J1.29), power_block (C32.2 D3.2)
LCD_PVDRV: host_board (J1.27), power_block (C35.2 C36.2 D5.1 R14.2)
DDR_A0: sdram_block (U7.N3), fpga_block (U1.K5)
DDR_A1: sdram_block (U7.P7), fpga_block (U1.K6)
DDR_A2: sdram_block (U7.P3), fpga_block (U1.D1)
DDR_A3: sdram_block (U7.N2), fpga_block (U1.L4)
DDR_A4: sdram_block (U7.P8), fpga_block (U1.G5)
DDR_A5: sdram_block (U7.P2), fpga_block (U1.H4)
DDR_A6: sdram_block (U7.R8), fpga_block (U1.H3)
DDR_A7: sdram_block (U7.R2), fpga_block (U1.D3)
DDR_A8: sdram_block (U7.T8), fpga_block (U1.B2)
DDR_A9: sdram_block (U7.R3), fpga_block (U1.A2)
DDR_A10: sdram_block (U7.L7), fpga_block (U1.G6)
DDR_A11: sdram_block (U7.R7), fpga_block (U1.E3)
DDR_A12: sdram_block (U7.N7), fpga_block (U1.F3)
DDR_A13: sdram_block (U7.T3), fpga_block (U1.F6)
DDR_A14: sdram_block (U7.T7), fpga_block (U1.F5)
DDR_BA0: sdram_block (U7.M2), fpga_block (U1.C3)
DDR_BA1: sdram_block (U7.N8), fpga_block (U1.C2)
DDR_BA2: sdram_block (U7.M3), fpga_block (U1.B1)
DDR_CAS: sdram_block (U7.K3), fpga_block (U1.H5)
DDR_CKE: sdram_block (R9.2 U7.K9), fpga_block (U1.F4)
DDR_CLK_N: sdram_block (R12.1 U7.K7), fpga_block (U1.E1)
DDR_CLK_P: sdram_block (R12.2 U7.J7), fpga_block (U1.E2)
DDR_D0: sdram_block (U7.E3), fpga_block (U1.G3)
DDR_D1: sdram_block (U7.F7), fpga_block (U1.J3)
DDR_D2: sdram_block (U7.F2), fpga_block (U1.G1)
DDR_D3: sdram_block (U7.F8), fpga_block (U1.K1)
DDR_D4: sdram_block (U7.H3), fpga_block (U1.F2)
DDR_D5: sdram_block (U7.H8), fpga_block (U1.K2)
DDR_D6: sdram_block (U7.G2), fpga_block (U1.F1)
DDR_D7: sdram_block (U7.H7), fpga_block (U1.J1)
DDR_D8: sdram_block (U7.D7), fpga_block (U1.R1)
DDR_D9: sdram_block (U7.C3), fpga_block (U1.M2)
DDR_D10: sdram_block (U7.C8), fpga_block (U1.R2)
DDR_D11: sdram_block (U7.C2), fpga_block (U1.L3)
DDR_D12: sdram_block (U7.A7), fpga_block (U1.P1)
DDR_D13: sdram_block (U7.A2), fpga_block (U1.L1)
DDR_D14: sdram_block (U7.B8), fpga_block (U1.P2)
DDR_D15: sdram_block (U7.A3), fpga_block (U1.M1)
DDR_DM0: sdram_block (U7.E7), fpga_block (U1.J4)
DDR_DM1: sdram_block (U7.D3), fpga_block (U1.K3)
DDR_LDQS_N: sdram_block (U7.G3), fpga_block (U1.H1)
DDR_LDQS_P: sdram_block (U7.F3), fpga_block (U1.H2)
DDR_ODT: sdram_block (R30.2 U7.K1), fpga_block (U1.L5)
DDR_RAS: sdram_block (U7.J3), fpga_block (U1.J6)
DDR_RESETN: sdram_block (R11.2 U7.T2), fpga_block (U1.E4)
DDR_UDQS_N: sdram_block (U7.B7), fpga_block (U1.N1)
DDR_UDQS_P: sdram_block (U7.C7), fpga_block (U1.N3)
DDR_WE: sdram_block (U7.L3), fpga_block (U1.C1)
DPHY_0_N: host_board (J1.3), Designator (R4#1.1 R5#1.2 R6#1.2)
DPHY_0_P: host_board (J1.2), Designator (R1#1.1 R2#1.2 R3#1.2)
DPHY_1_N: host_board (J1.6), Designator (R4#2.1 R5#2.2 R6#2.2)
DPHY_1_P: host_board (J1.5), Designator (R1#2.1 R2#2.2 R3#2.2)
DPHY_2_N: host_board (J1.9), Designator (R4#3.1 R5#3.2 R6#3.2)
DPHY_2_P: host_board (J1.8), Designator (R1#3.1 R2#3.2 R3#3.2)
DPHY_3_N: host_board (J1.12), Designator (R4#4.1 R5#4.2 R6#4.2)
DPHY_3_P: host_board (J1.11), Designator (R1#4.1 R2#4.2 R3#4.2)
DPHY_4_N: host_board (J1.15), Designator (R4#5.1 R5#5.2 R6#5.2)
DPHY_4_P: host_board (J1.14), Designator (R1#5.1 R2#5.2 R3#5.2)
DPHY_HS0_N: Designator (R5#1.1), fpga_block (U1.A9)
DPHY_HS0_P: Designator (R2#1.1), fpga_block (U1.C9)
DPHY_HS1_N: Designator (R5#2.1), fpga_block (U1.E8)
DPHY_HS1_P: Designator (R2#2.1), fpga_block (U1.E7)
DPHY_HS2_N: Designator (R5#3.1), fpga_block (U1.E6)
DPHY_HS2_P: Designator (R2#3.1), fpga_block (U1.F7)
DPHY_HS3_N: Designator (R5#4.1), fpga_block (U1.C6)
DPHY_HS3_P: Designator (R2#4.1), fpga_block (U1.D6)
DPHY_HS_CLK_N: Designator (R5#5.1), fpga_block (U1.C5)
DPHY_HS_CLK_P: Designator (R2#5.1), fpga_block (U1.D5)
DPHY_LP_CLK_N: Designator (R6#5.1), fpga_block (U1.B6)
DPHY_LP_CLK_P: Designator (R1#5.2), fpga_block (U1.A5)
DPHY_LP_N0: Designator (R6#1.1), fpga_block (U1.B10)
DPHY_LP_N1: Designator (R6#2.1), fpga_block (U1.E10)
DPHY_LP_N2: Designator (R6#3.1), fpga_block (U1.C7)
DPHY_LP_N3: Designator (R6#4.1), fpga_block (U1.B8)
DPHY_LP_P0: Designator (R1#1.2), fpga_block (U1.A8)
DPHY_LP_P1: Designator (R1#2.2), fpga_block (U1.A10)
DPHY_LP_P2: Designator (R1#3.2), fpga_block (U1.A6)
DPHY_LP_P3: Designator (R1#4.2), fpga_block (U1.A7)
DSI_GPIO0: host_board (J1.22), fpga_block (U1.C8)
DSI_GPIO1: host_board (J1.23), fpga_block (U1.C11)
DSI_GPIO2: host_board (J1.24), fpga_block (U1.A11)
DSI_GPIO3: host_board (J1.25), fpga_block (U1.F9)
DSI_RESET_N: host_board (J1.21), fpga_block (U1.C10)
HDMI_CEC_LV: fpga_block (R57.2), adv_block (R64.2), hdmi_block (R52.1 U10.16)
HDMI_CFG_SCL: fpga_block (U1.K12), adv_block (R60.1 U9.53)
HDMI_CFG_SDA: fpga_block (U1.K14), adv_block (R63.1 U9.54)
HDMI_D0: fpga_block (U1.H14), adv_block (U9.43)
HDMI_D1: fpga_block (U1.H13), adv_block (U9.42)
HDMI_D2: fpga_block (U1.H11), adv_block (U9.41)
HDMI_D3: fpga_block (U1.G12), adv_block (U9.39)
HDMI_D4: fpga_block (U1.H16), adv_block (U9.38)
HDMI_D5: fpga_block (U1.H15), adv_block (U9.37)
HDMI_D6: fpga_block (U1.G16), adv_block (U9.36)
HDMI_D7: fpga_block (U1.G14), adv_block (U9.35)
HDMI_D8: fpga_block (U1.F16), adv_block (U9.33)
HDMI_D9: fpga_block (U1.F15), adv_block (U9.32)
HDMI_D10: fpga_block (U1.E16), adv_block (U9.31)
HDMI_D11: fpga_block (U1.E15), adv_block (U9.30)
HDMI_D12: fpga_block (U1.C16), adv_block (U9.29)
HDMI_D13: fpga_block (U1.C15), adv_block (U9.28)
HDMI_D14: fpga_block (U1.F14), adv_block (U9.27)
HDMI_D15: fpga_block (U1.F13), adv_block (U9.26)
HDMI_D16: fpga_block (U1.D16), adv_block (U9.22)
HDMI_D17: fpga_block (U1.D14), adv_block (U9.21)
HDMI_D18: fpga_block (U1.G11), adv_block (U9.20)
HDMI_D19: fpga_block (U1.F12), adv_block (U9.19)
HDMI_D20: fpga_block (U1.B16), adv_block (U9.18)
HDMI_D21: fpga_block (U1.B15), adv_block (U9.17)
HDMI_D22: fpga_block (U1.E12), adv_block (U9.16)
HDMI_D23: fpga_block (U1.E13), adv_block (U9.15)
HDMI_DE: fpga_block (U1.J13), adv_block (U9.45)
HDMI_HPD_LV: adv_block (U9.1), hdmi_block (R53.1 U10.19)
HDMI_HS: fpga_block (U1.J12), adv_block (U9.46)
HDMI_LCC: fpga_block (U1.J14), adv_block (U9.25)
HDMI_RST_N: fpga_block (U1.K11), adv_block (U9.56)
HDMI_SCL_LV: fpga_block (U1.R15), adv_block (U9.62), hdmi_block (R51.1 U10.17)
HDMI_SDA_LV: fpga_block (U1.P16), adv_block (U9.63), hdmi_block (R50.1 U10.18)
HDMI_VS: fpga_block (U1.J11), adv_block (U9.47)
HDP_EN: fpga_block (U1.R14), hdmi_block (R70.2 T1.1)
HPD_NOTIF: fpga_block (U1.T15), hdmi_block (R61.1 R62.2)
LCD_BL_A: host_board (J1.31), power_block (C29.2 D6.1 D7.1)
LCD_BL_FB: host_board (J1.32), power_block (R27.2 U6.3)
LCD_BOOST_FB: host_board (J1.30), power_block (C36.1 R14.1 R28.2 U5.3)
LCD_PWREN: fpga_block (U1.D8), power_block (R29.2 U5.4)
RST_CPU: fpga_block (R39.2), uartjtag_block (U4.23)
TCK: fpga_block (P1.6 R37.1 U1.C14), uartjtag_block (R86.2)
TDI: fpga_block (P1.5 U1.C12), uartjtag_block (R85.2)
TDO: fpga_block (P1.4 U1.E14), uartjtag_block (R84.2)
TMDS0_N: fpga_block (R69.1 U1.T13), adv_block (U9.6), hdmi_block (P4.9 U10.12 U10.27)
TMDS0_P: fpga_block (R71.1 U1.T14), adv_block (U9.7), hdmi_block (P4.7 U10.10 U10.29)
TMDS1_N: fpga_block (R67.1 U1.T12), adv_block (U9.9), hdmi_block (P4.6 U10.9 U10.30)
TMDS1_P: fpga_block (R68.1 U1.R12), adv_block (U9.10), hdmi_block (P4.4 U10.7 U10.32)
TMDS2_N: fpga_block (R73.2 U1.L13), adv_block (U9.12), hdmi_block (P4.3 U10.6 U10.33)
TMDS2_P: fpga_block (R72.2 U1.L12), adv_block (U9.13), hdmi_block (P4.1 U10.4 U10.35)
TMDS_CLK_N: fpga_block (R89.2 U1.M14), adv_block (U9.3), hdmi_block (P4.12 U10.15 U10.24)
TMDS_CLK_P: fpga_block (R88.2 U1.M13), adv_block (U9.4), hdmi_block (P4.10 U10.13 U10.26)
TMS: fpga_block (P1.3 U1.A15), uartjtag_block (R87.2)
UART_RX: fpga_block (U1.N12), uartjtag_block (LD9.2 U4.24)
UART_TX: fpga_block (U1.P12), uartjtag_block (LD8.2 U4.25)